# Altium schematic sheet Block Diagram.SchDoc: [2] Block Diagram
size A4; ApprovedBy: Nagy Richard; CheckedBy: Nagy Richard; Author: Nagy Richard; CompanyName: EmbedCore; DrawnBy: Nagy Richard; Engineer: Nagy Richard; Organization: EmbedCore; DocumentNumber: 2; Revision: 1.0; SheetNumber: 2; SheetTotal: 14
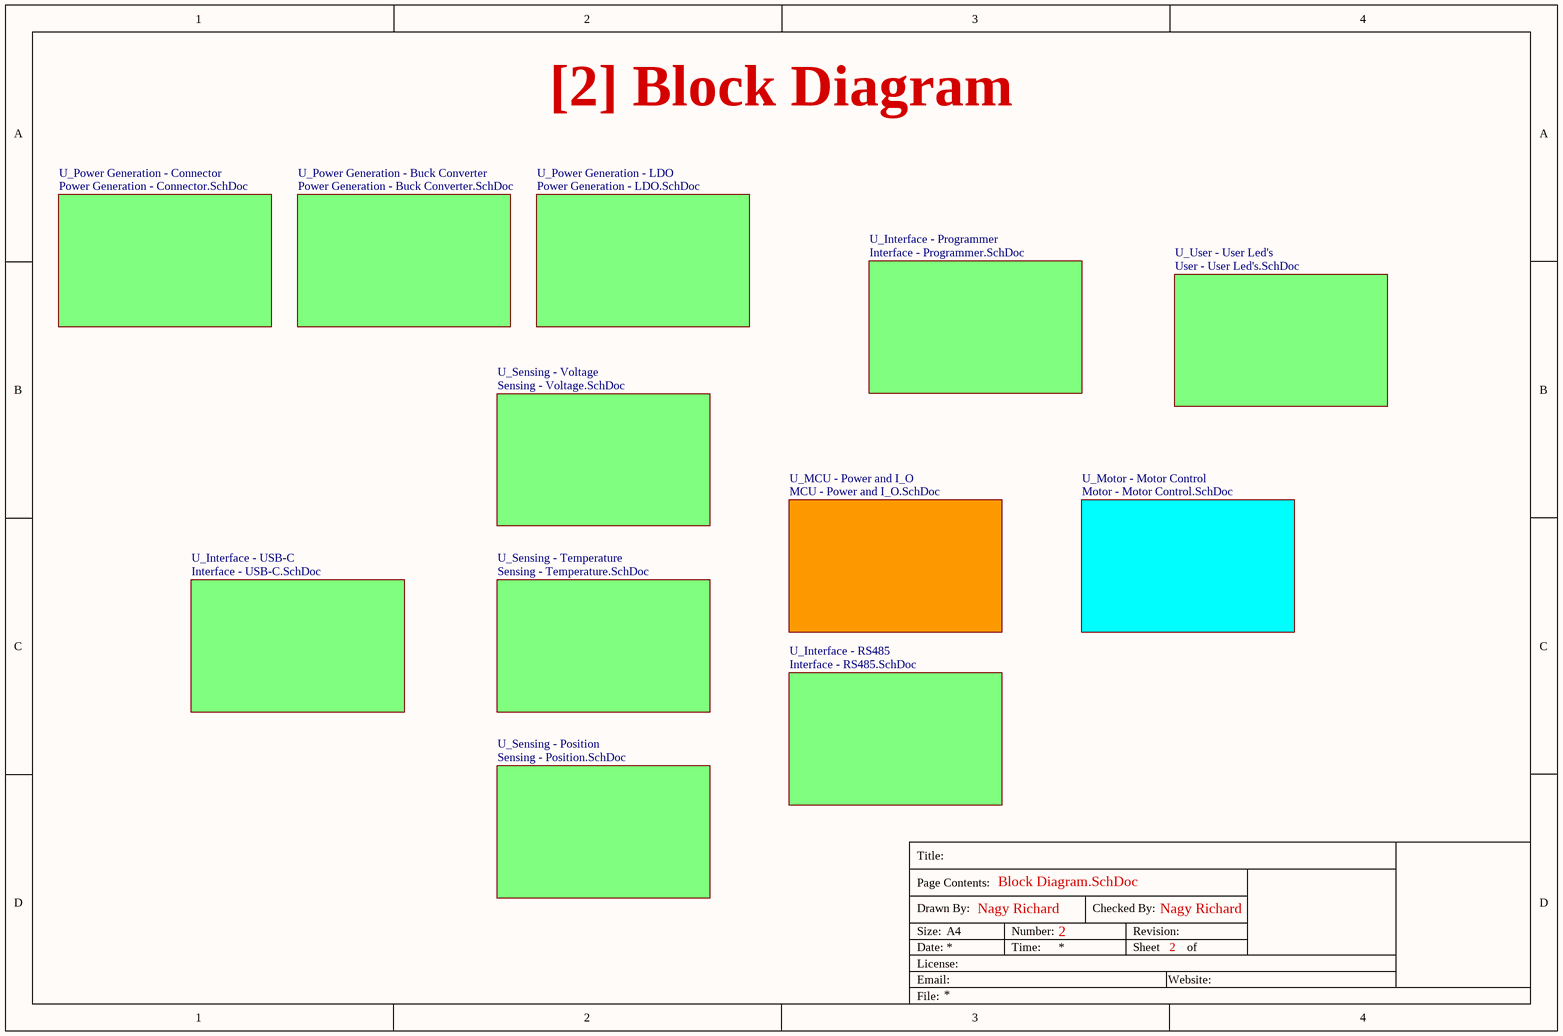
[diagram p0: Block Diagram.SchDoc]

## Sub-sheets
U_Interface - Programmer = Interface - Programmer.SchDoc: no entries
U_Interface - RS485 = Interface - RS485.SchDoc: no entries
U_Interface - USB-C = Interface - USB-C.SchDoc: no entries
U_MCU - Power and I_O = MCU - Power and I_O.SchDoc: no entries
U_Motor - Motor Control = Motor - Motor Control.SchDoc: no entries
U_Power Generation - Buck Converter = Power Generation - Buck Converter.SchDoc: no entries
U_Power Generation - Connector = Power Generation - Connector.SchDoc: no entries
U_Power Generation - LDO = Power Generation - LDO.SchDoc: no entries
U_Sensing - Position = Sensing - Position.SchDoc: no entries
U_Sensing - Temperature = Sensing - Temperature.SchDoc: no entries
U_Sensing - Voltage = Sensing - Voltage.SchDoc: no entries
U_User - User Led's = User - User Led's.SchDoc: no entries

## Notes on the sheet
- Title:
- Drawn By:
- Page Contents:
- Checked By:
- Size:
- Date:
- File:
- License:
- Email:
- A4
- Number:
- Time:
- Revision:
- Sheet
- Website:
- of